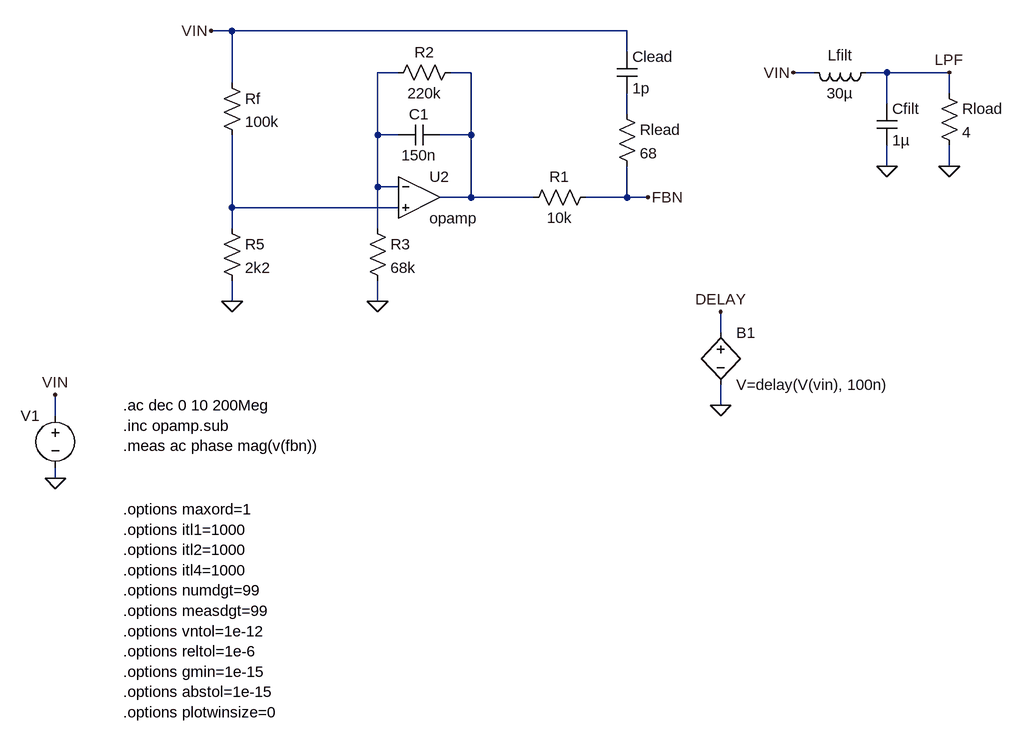
[diagram p0: schematic SmallSignal.asc]
SmallSignal.asc, the LTspice schematic file:
Version 4
SHEET 1 1704 1148
WIRE 256 32 224 32
WIRE 864 32 256 32
WIRE 864 64 864 32
WIRE 512 96 480 96
WIRE 624 96 592 96
WIRE 1152 96 1120 96
WIRE 1264 96 1232 96
WIRE 1360 96 1264 96
WIRE 256 112 256 32
WIRE 1360 128 1360 96
WIRE 1264 144 1264 96
WIRE 864 160 864 128
WIRE 480 192 480 96
WIRE 512 192 480 192
WIRE 624 192 624 96
WIRE 624 192 576 192
WIRE 1264 240 1264 208
WIRE 1360 240 1360 208
WIRE 480 272 480 192
WIRE 512 272 480 272
WIRE 624 288 624 192
WIRE 624 288 576 288
WIRE 720 288 624 288
WIRE 864 288 864 240
WIRE 864 288 800 288
WIRE 896 288 864 288
WIRE 256 304 256 192
WIRE 512 304 256 304
WIRE 256 336 256 304
WIRE 480 336 480 272
WIRE 256 448 256 416
WIRE 480 448 480 416
WIRE 1008 496 1008 464
WIRE 1008 608 1008 576
WIRE -16 624 -16 592
WIRE -16 720 -16 704
FLAG 1264 240 0
FLAG 1360 240 0
FLAG 480 448 0
FLAG -16 720 0
FLAG 1120 96 VIN
FLAG -16 592 VIN
FLAG 1360 96 LPF
FLAG 224 32 VIN
FLAG 896 288 FBN
FLAG 1008 608 0
FLAG 1008 464 DELAY
FLAG 256 448 0
SYMBOL Voltage -16 608 M0
SYMATTR InstName V1
SYMATTR Value ""
SYMATTR Value2 AC 1
SYMBOL Res 240 96 R0
SYMATTR InstName Rf
SYMATTR Value 100k
SYMBOL Res 848 144 R0
SYMATTR InstName Rlead
SYMATTR Value 68
SYMBOL Cap 848 64 R0
SYMATTR InstName Clead
SYMATTR Value 1p
SYMBOL ind 1248 80 R90
WINDOW 0 5 56 VBottom 2
WINDOW 3 32 56 VTop 2
SYMATTR InstName Lfilt
SYMATTR Value 30µ
SYMBOL Cap 1248 144 R0
SYMATTR InstName Cfilt
SYMATTR Value 1µ
SYMBOL Res 1344 112 R0
SYMATTR InstName Rload
SYMATTR Value 4
SYMBOL Res 816 272 R90
WINDOW 0 0 56 VBottom 2
WINDOW 3 32 56 VTop 2
SYMATTR InstName R1
SYMATTR Value 10k
SYMBOL OpAmps/opamp 544 224 R0
SYMATTR InstName U2
SYMBOL Res 608 80 R90
WINDOW 0 0 56 VBottom 2
WINDOW 3 32 56 VTop 2
SYMATTR InstName R2
SYMATTR Value 220k
SYMBOL Cap 576 176 R90
WINDOW 0 0 32 VBottom 2
WINDOW 3 32 32 VTop 2
SYMATTR InstName C1
SYMATTR Value 150n
SYMBOL Res 464 320 R0
SYMATTR InstName R3
SYMATTR Value 68k
SYMBOL bv 1008 480 R0
SYMATTR InstName B1
SYMATTR Value V=delay(V(vin), 100n)
SYMBOL Res 240 320 R0
SYMATTR InstName R5
SYMATTR Value 2k2
TEXT 88 608 Left 2 !.ac dec 0 10 200Meg\n.inc opamp.sub\n.meas ac phase mag(v(fbn))
TEXT 88 768 Left 2 !.options maxord=1\n.options itl1=1000\n.options itl2=1000\n.options itl4=1000\n.options numdgt=99\n.options measdgt=99\n.options vntol=1e-12\n.options reltol=1e-6\n.options gmin=1e-15\n.options abstol=1e-15\n.options plotwinsize=0

The netlist it stands for:
* SmallSignal.asc
V1 VIN 0 AC 1
Rf VIN N004 100k
Rlead N003 FBN 68
Clead VIN N003 1p
Lfilt LPF VIN 30µ
Cfilt LPF 0 1µ
Rload LPF 0 4
R1 FBN N002 10k
XU2 N001 N004 N002 opamp Aol=100K GBW=10Meg  ; pins invin noninvin out
R2 N002 N001 220k
C1 N002 N001 150n
R3 N001 0 68k
B1 DELAY 0 V=delay(V(vin), 100n)
R5 N004 0 2k2
.ac dec 0 10 200Meg
.inc opamp.sub
.meas ac phase mag(v(fbn))
.options maxord=1
.options itl1=1000
.options itl2=1000
.options itl4=1000
.options numdgt=99
.options measdgt=99
.options vntol=1e-12
.options reltol=1e-6
.options gmin=1e-15
.options abstol=1e-15
.options plotwinsize=0
.backanno
.end